# EAGLE schematic dip_picker (EAGLE 9.3.1)
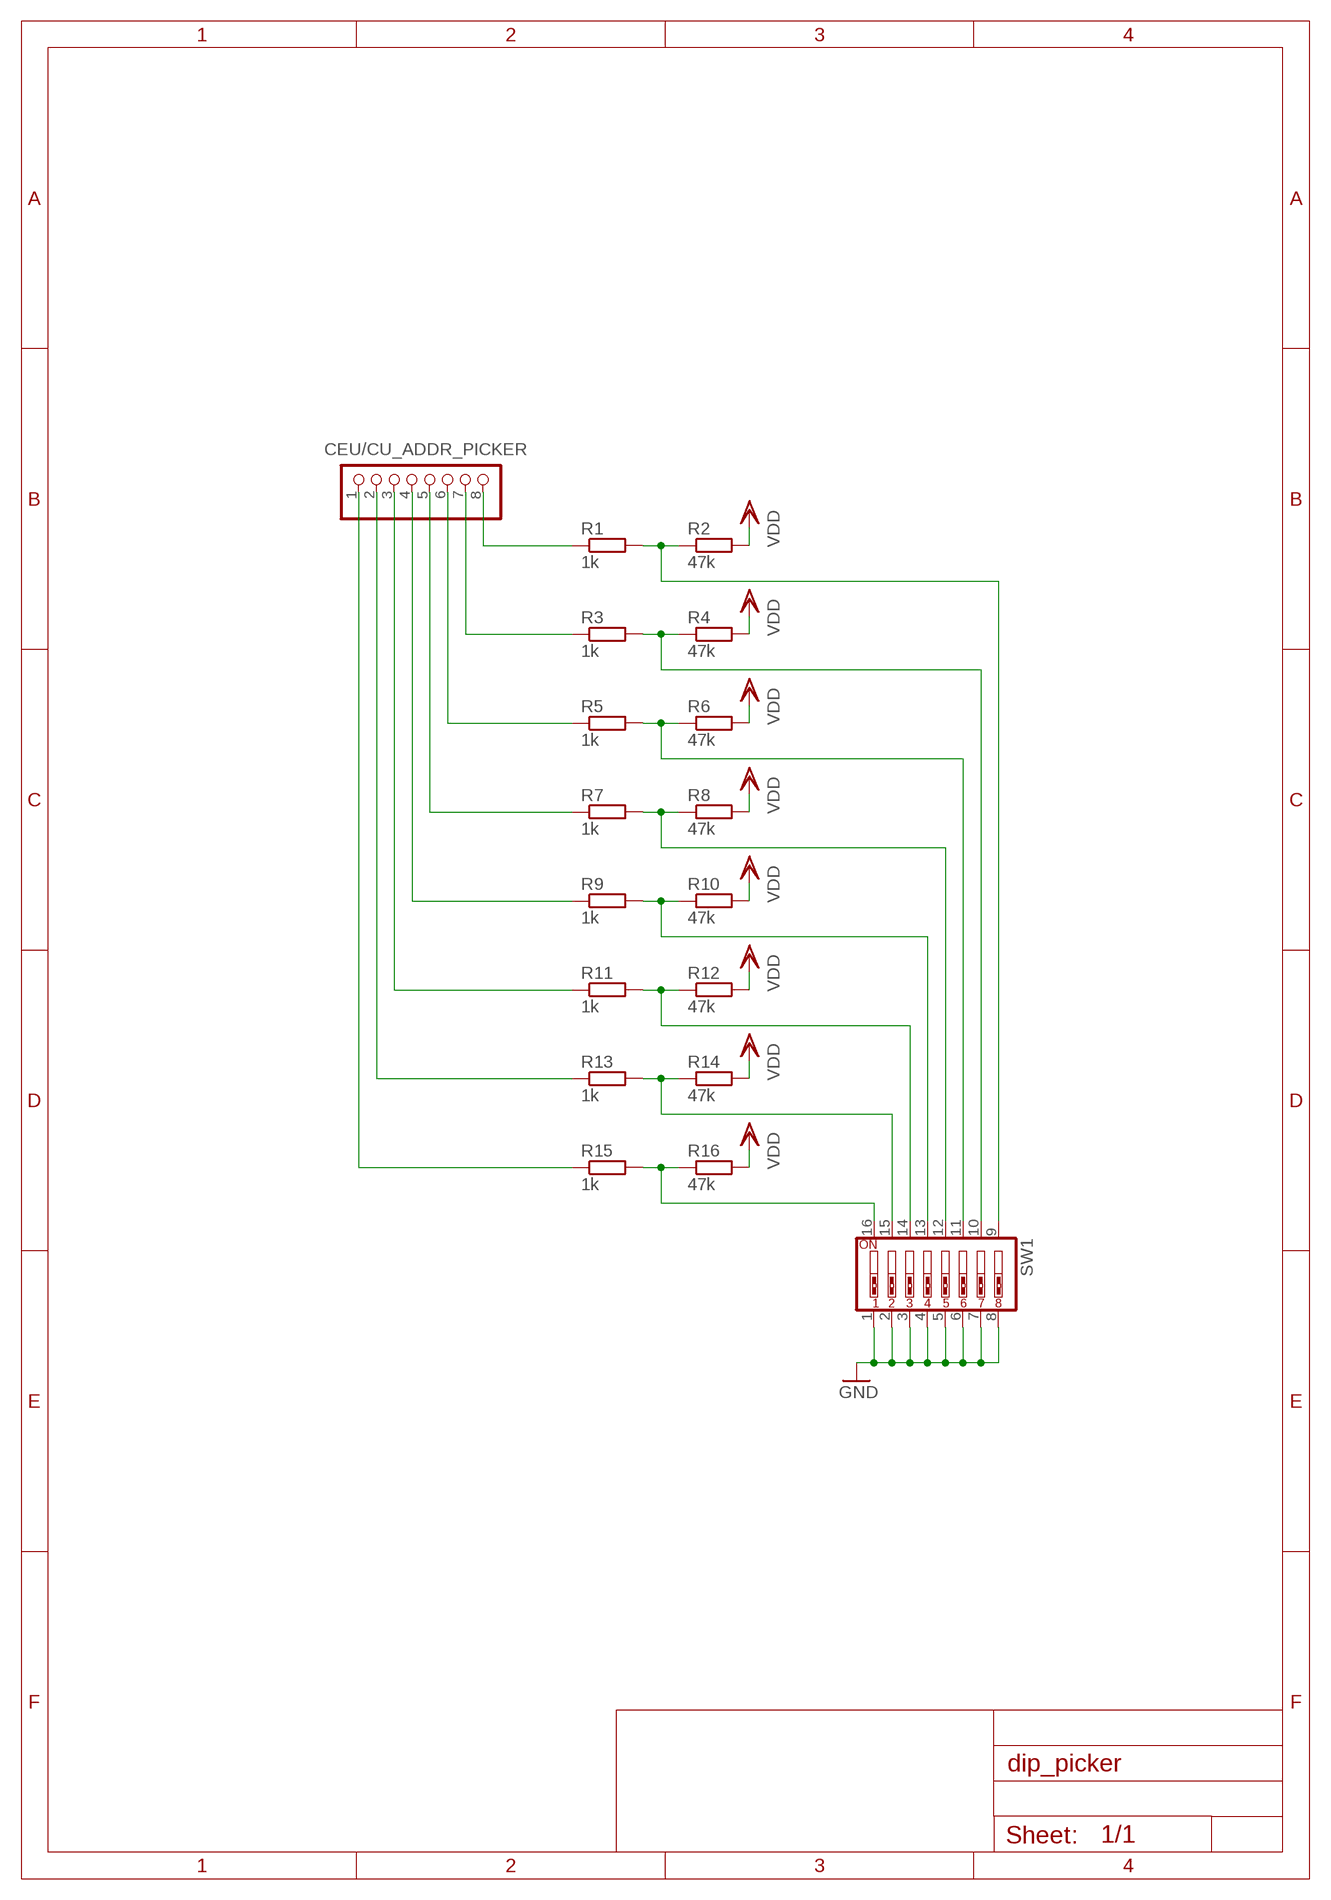
[diagram p0: schematic, sheet 1]

## Parts
CEU/CU_ADDR_PICKER  PINHD-1X8  [1X08]
R1  1k  R-EU_0207/7  [0207/7]
R2  47k  R-EU_0207/7  [0207/7]
R3  1k  R-EU_0207/7  [0207/7]
R4  47k  R-EU_0207/7  [0207/7]
R5  1k  R-EU_0207/7  [0207/7]
R6  47k  R-EU_0207/7  [0207/7]
R7  1k  R-EU_0207/7  [0207/7]
R8  47k  R-EU_0207/7  [0207/7]
R9  1k  R-EU_0207/7  [0207/7]
R10  47k  R-EU_0207/7  [0207/7]
R11  1k  R-EU_0207/7  [0207/7]
R12  47k  R-EU_0207/7  [0207/7]
R13  1k  R-EU_0207/7  [0207/7]
R14  47k  R-EU_0207/7  [0207/7]
R15  1k  R-EU_0207/7  [0207/7]
R16  47k  R-EU_0207/7  [0207/7]
SW1  SW_DIP-8  [EDG-08]

## Nets
GND: SW1.1 SW1.2 SW1.3 SW1.4 SW1.5 SW1.6 SW1.7 SW1.8
N$1: R1.2 R2.1 SW1.9
N$2: R3.2 R4.1 SW1.10
N$3: R5.2 R6.1 SW1.11
N$4: R7.2 R8.1 SW1.12
N$5: R9.2 R10.1 SW1.13
N$6: R11.2 R12.1 SW1.14
N$7: R13.2 R14.1 SW1.15
N$8: R15.2 R16.1 SW1.16
N$9: CEU/CU_ADDR_PICKER.8 R1.1
N$10: CEU/CU_ADDR_PICKER.7 R3.1
N$11: CEU/CU_ADDR_PICKER.6 R5.1
N$12: CEU/CU_ADDR_PICKER.5 R7.1
N$13: CEU/CU_ADDR_PICKER.4 R9.1
N$14: CEU/CU_ADDR_PICKER.3 R11.1
N$15: CEU/CU_ADDR_PICKER.2 R13.1
N$16: CEU/CU_ADDR_PICKER.1 R15.1
VDD: R2.2 R4.2 R6.2 R8.2 R10.2 R12.2 R14.2 R16.2

## Library data of the parts
CEU/CU_ADDR_PICKER = pinhead:PINHD-1X8: PIN HEADER
R1-R16 = rcl:R-EU_: RESISTOR, European symbol; SPICEPREFIX: R
SW1 = special:SW_DIP-8: DIP SWITCH